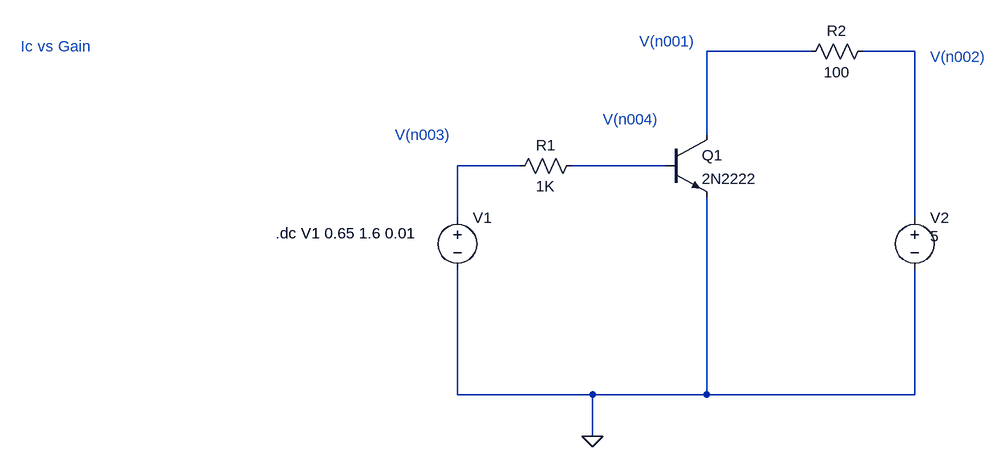
[diagram p0: schematic 5.1.asc]
5.1.asc, the LTspice schematic file:
Version 4
SHEET 1 888 680
WIRE 608 -176 448 -176
WIRE 768 -176 688 -176
WIRE 448 -48 448 -176
WIRE 160 0 64 0
WIRE 384 0 240 0
WIRE 64 80 64 0
WIRE 768 80 768 -176
WIRE 64 352 64 160
WIRE 272 352 64 352
WIRE 448 352 448 48
WIRE 448 352 272 352
WIRE 768 352 768 160
WIRE 768 352 448 352
WIRE 272 416 272 352
FLAG 272 416 0
SYMBOL res 256 -16 R90
WINDOW 0 0 56 VBottom 2
WINDOW 3 32 56 VTop 2
SYMATTR InstName R1
SYMATTR Value 1K
SYMBOL npn 384 -48 R0
SYMATTR InstName Q1
SYMATTR Value 2N2222
SYMBOL res 704 -192 R90
WINDOW 0 0 56 VBottom 2
WINDOW 3 32 56 VTop 2
SYMATTR InstName R2
SYMATTR Value 100
SYMBOL voltage 64 64 R0
SYMATTR InstName V1
SYMATTR Value ""
SYMBOL voltage 768 64 R0
WINDOW 3 24 44 Left 2
WINDOW 123 0 0 Left 0
WINDOW 39 0 0 Left 0
SYMATTR InstName V2
SYMATTR Value 5
TEXT -32 -48 Left 2 ;V(n003)
TEXT 288 -72 Left 2 ;V(n004)
TEXT 344 -192 Left 2 ;V(n001)
TEXT 792 -168 Left 2 ;V(n002)
TEXT -216 104 Left 2 !.dc V1 0.65 1.6 0.01
TEXT -608 -184 Left 2 ;Ic vs Gain

The netlist it stands for:
* 5.1.asc
R1 N004 N003 1K
Q1 N001 N004 0 0 2N2222
R2 N002 N001 100
V1 N003 0
V2 N002 0 5
.model NPN NPN
.model PNP PNP
.lib standard.bjt
* V(n003)
* V(n004)
* V(n001)
* V(n002)
.dc V1 0.65 1.6 0.01
* Ic vs Gain
.backanno
.end

* Results of the author's LTspice run, read from the files saved beside the schematic
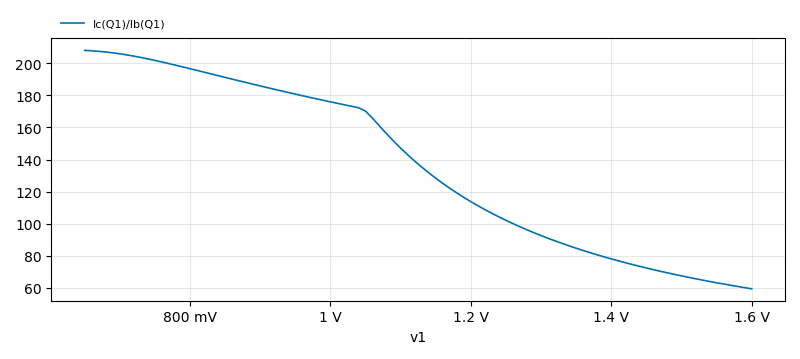
[diagram p1: DC transfer characteristic of 5.1.asc, plotted from the saved traces]
* DC transfer characteristic, 1 run:
*   Ic(Q1)/Ib(Q1): 208.1  at v1=650 mV, 59.46  at v1=1.6 V, min 59.46 , max 208.1 